# Altium schematic sheet Buzzer.SchDoc
size A4; SheetNumber: 10; SheetTotal: 11
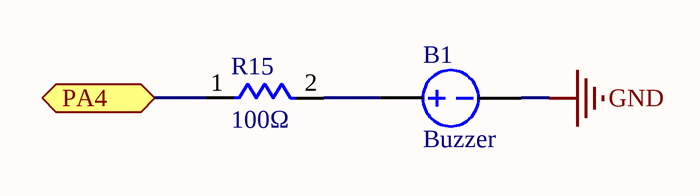
[diagram p0: Buzzer.SchDoc]

## Parts
B1  Buzzer  [Buzzer]
R15  100Ω  [RES - 0603]

## Ports
PA4 (bidir)

## Nets
GND: B1.2
PA4: R15.1 ; port PA4
NetB1_1: B1.1 R15.2

## Library data of the parts
R15 = Res: SMD Res; ComponentLink1Description: Datasheet; ComponentLink1URL: https://cdn.ozdisan.com/ETicaret_Dosya/570122_9878629.pdf; ComponentLink2Description: Satın Alma Linki; ComponentLink2URL: https://www.ozdisan.com/pasif-komponentler/direncler/smt-smd-direncler/TC0325B3301T5C; ComponentLink3Description: Satın Alma Linki; ComponentLink3URL: https://ozdisan.com/pasif-komponentler/direncler/smt-smd-ve-cip-direncler/0603SAF4701T5E; ComponentLink4Description: Satın Alma Linki; ComponentLink4URL: https://ozdisan.com/pasif-komponentler/direncler/smt-smd-ve-cip-direncler/0805S8F604JT5E; ComponentLink5Description: Satın Alma Linki; ComponentLink5URL: https://ozdisan.com/pasif-komponentler/direncler/smt-smd-ve-cip-direncler/0603SAF1022T5E; ComponentLink6Description: Satın Alma Linki; ComponentLink6URL: https://www.ozdisan.com/pasif-komponentler/direncler/smt-smd-direncler/CQ03SAF0000T5E
B1 = Buzzer: ComponentLink1Description: Satın Alma Linki; ComponentLink1URL: https://www.robotistan.com/buzzer; ComponentLink2Description: Datasheet; ComponentLink2URL: *